# Altium schematic sheet BUZZERS.SchDoc
size A3; SheetNumber: 5; SheetTotal: 8
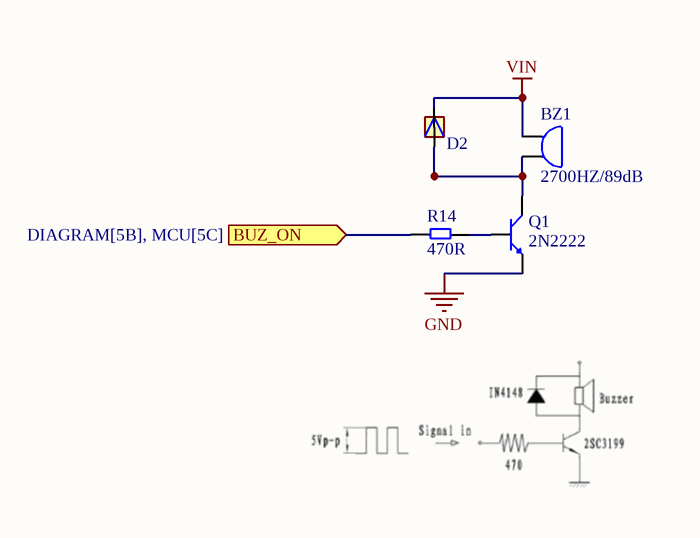
[diagram p0: BUZZERS.SchDoc]

## Parts
BZ1  2700HZ/89dB  [BUZZER_1209]
D2  0.15A/75V  [SOD323]  (value not drawn)
Q1  2N2222  [TO92254P470H750-3]
R14  470R  [RES-SMD-0805]

## Ports
BUZ_ON (in, see DIAGRAM[5B], MCU[5C])

## Nets
GND: Q1.1(E)
VIN: BZ1.1 D2.C
BUZ_ON: R14.1 ; port BUZ_ON
NetBZ1_2: BZ1.2 D2.A Q1.2(C)
NetQ1_3: Q1.3(B) R14.2

## Library data of the parts
BZ1 = BUZZER
D2 = ID-32: 1N4148W Diode Chỉnh Lưu 0.15A 75V SOD323; MF: Diotec Semiconductor; MP: 1N4148WS; SnapEDA_Link: https://www.snapeda.com/parts/1N4148WS/Diotec/view-part/?ref=snap; Package: SOD-323F Diotec; Value: 0.15A/75V; Check_prices: https://www.snapeda.com/parts/1N4148WS/Diotec/view-part/?ref=eda; Design Item ID: ID-32
Q1 = ID-30: P2N2222A Transistor NPN 40V 0.6A 3 Chân TO-92; Design Item ID: ID-30; Value: 2N2222
R14 = ID-31: Điện Trở 470 Ohm 0805 1%; Design Item ID: ID-31; Value: 470R